# Altium schematic sheet ISD1730.SchDoc
size A; SheetNumber: 5; SheetTotal: 13
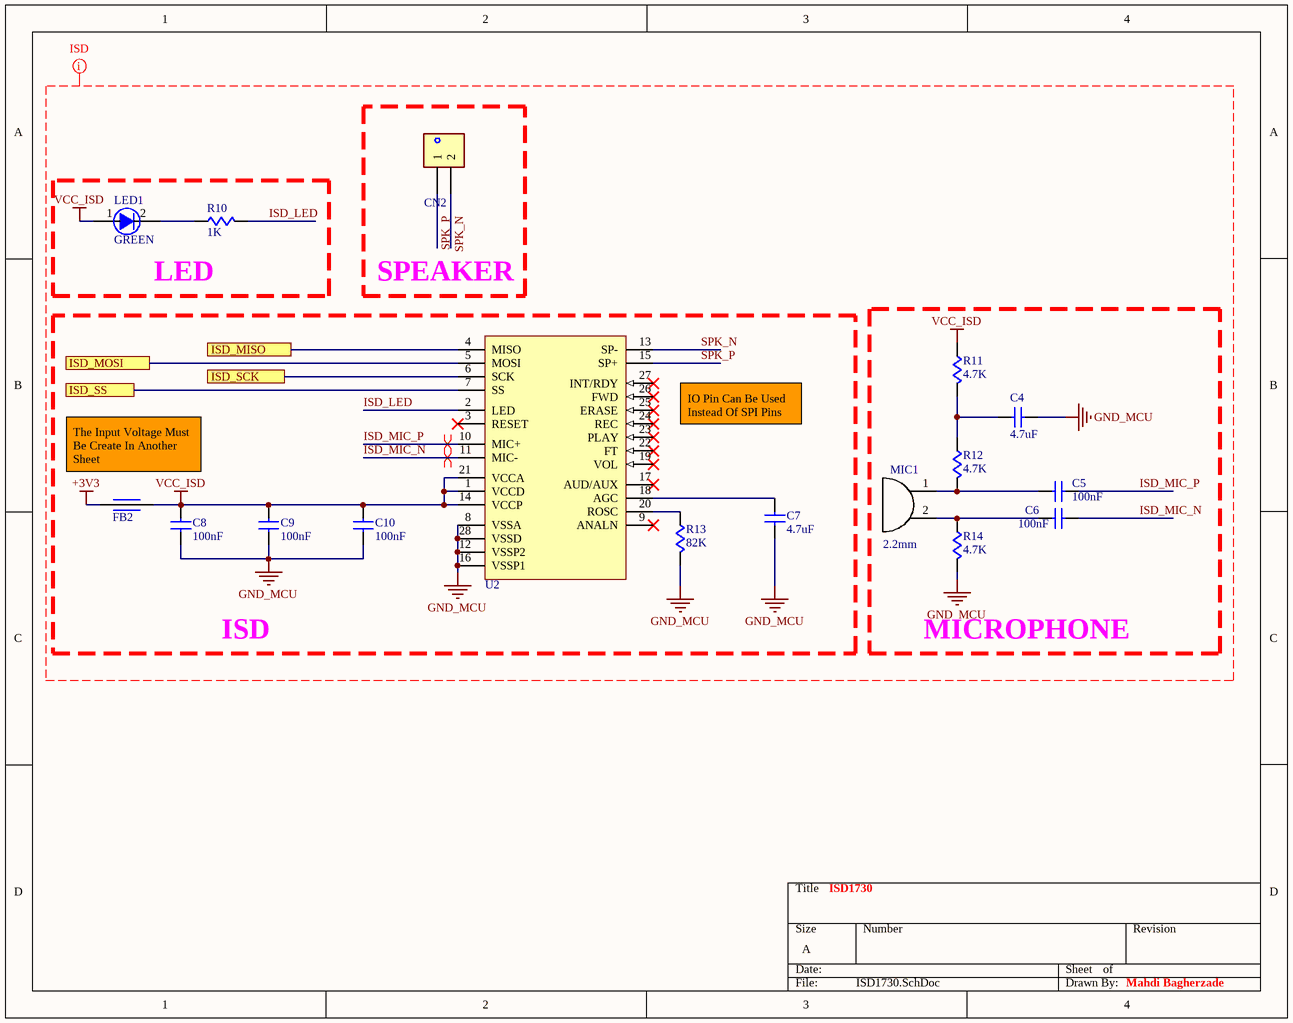
[diagram p0: ISD1730.SchDoc]

## Parts
C4  value 4.7uF  [C-0805]  (hidden comment: CAP Cer 4.7uF-50V-X7R-SMD)
C5  value 100nF  [C-0805]  (hidden comment: CAP Cer 100nF-50V-X7R-SMD)
C6  value 100nF  [C-0805]  (hidden comment: CAP Cer 100nF-50V-X7R-SMD)
C7  value 4.7uF  [C-0805]  (hidden comment: CAP Cer 4.7uF-50V-X7R-SMD)
C8  value 100nF  [C-0805]  (hidden comment: CAP Cer 100nF-50V-X7R-SMD)
C9  value 100nF  [C-0805]  (hidden comment: CAP Cer 100nF-50V-X7R-SMD)
C10  value 100nF  [C-0805]  (hidden comment: CAP Cer 100nF-50V-X7R-SMD)
CN2  Connector XH-2-Straight-THD-2.54mm  [XH-2]  (value not drawn)
FB2  Ferrite Bead SMD  [FB-0805]  (value not drawn)
LED1  Color: GREEN  [LED-1206-Y]  (hidden comment: LED GREEN-1206-SMD)
MIC1  Size: 2.2mm  [MIC-2.2mm]  (hidden comment: Mic 2.2mm-THD)
R10  value 1K  [R-0805]  (hidden comment: RES 1K-5%-1/8W-SMD)
R11  value 4.7K  [R-0805]  (hidden comment: RES 4.7K-5%-1/8W-SMD)
R12  value 4.7K  [R-0805]  (hidden comment: RES 4.7K-5%-1/8W-SMD)
R13  value 82K  [R-0805]  (hidden comment: RES 82K-5%-1/8W-SMD)
R14  value 4.7K  [R-0805]  (hidden comment: RES 4.7K-5%-1/8W-SMD)
U2  IC ISD1730-SMD  [SOIC28-wide]  (value not drawn)

## Blocks framed on the sheet
SPEAKER: CN2
LED: LED1 R10
ISD: C7-C10 FB2 R13 U2
MICROPHONE: C4-C6 MIC1 R11 R12 R14

## Ports
ISD_MISO (see Interface[3B]), ISD_MOSI (see Interface[3B]), ISD_SCK (see Interface[3B]), ISD_SS (see Interface[3B], MCU[3C])

## Nets
+3V3: FB2.1
GND_MCU: C4.2 C7.2 C8.2 C9.2 C10.2 R13.2 R14.2 U2.8(VSSA) U2.12(VSSP2) U2.16(VSSP1) U2.28(VSSD)
VCC_ISD: C8.1 C9.1 C10.1 FB2.2 LED1.1(A) R11.1 U2.1(VCCD) U2.14(VCCP) U2.21(VCCA)
ISD_LED: R10.2 U2.2(LED)
ISD_MIC_N: C6.2 U2.11(MIC-)
ISD_MIC_P: C5.2 U2.10(MIC+)
ISD_MISO: U2.4(MISO) ; port ISD_MISO
ISD_MOSI: U2.5(MOSI) ; port ISD_MOSI
ISD_SCK: U2.6(SCK) ; port ISD_SCK
ISD_SS: U2.7(SS) ; port ISD_SS
SPK_N: CN2.2 U2.13(SP-)
SPK_P: CN2.1 U2.15(SP+)
NetC4_1: C4.1 R11.2 R12.1
NetC5_1: C5.1 MIC1.1 R12.2
NetC6_1: C6.1 MIC1.2 R14.1
NetC7_1: C7.1 U2.18(AGC)
NetLED1_2: LED1.2(C) R10.1
NetR13_1: R13.1 U2.20(ROSC)

Not connected (* = marked no-connect by the designer): U2 3(RESET)* 9(ANALN)* 17(AUD/AUX)* 19(VOL)* 22(FT)* 23(PLAY)* 24(REC)* 25(ERASE)* 26(FWD)* 27(INT/RDY)*

## Layout directives
differential pair: ISD_MIC_N, ISD_MIC_P
net class ISD: +3V3, GND_MCU, ISD_LED, ISD_MIC_N, ISD_MIC_P, SPK_N, SPK_P, VCC_ISD

## Notes on the sheet
- IO Pin Can Be Used Instead Of SPI Pins
- The Input Voltage Must Be Create In Another Sheet
- ISD1730
- Mahdi Bagherzade

## Library data of the parts
C4-C10 = CAP-CER: CAPACITOR; Phone Number: 0915 8700 314; Voltage: 50V; Tolerance: X7R; Type: SMD; Publisher: Mahdi Bagherzadeh; ComponentLink1Description: Linkedin; ComponentLink1URL: https://ir.linkedin.com/in/mahdi-bagherzade; Published Date: 9-15-2024
CN2 = CN-2pin: CONNECTOR; Phone Number: 0915 8700 314; Value: XH-2; Publisher: Mahdi Bagherzadeh; ComponentLink1Description: Linkedin; ComponentLink1URL: https://ir.linkedin.com/in/mahdi-bagherzade; Published Date: 9-15-2024; Size: 2.54mm; Type: Straight-THD
FB2 = FERRITE BEAD: INDUCATOR; Phone Number: 0915 8700 314; Publisher: Mahdi Bagherzadeh; ComponentLink1Description: Linkedin; ComponentLink1URL: https://ir.linkedin.com/in/mahdi-bagherzade; Published Date: 9-15-2024; Type: SMD
LED1 = LED: Phone Number: 0915 8700 314; Type: SMD; Publisher: Mahdi Bagherzadeh; ComponentLink1Description: Linkedin; ComponentLink1URL: https://ir.linkedin.com/in/mahdi-bagherzade; Published Date: 9-15-2024; Size: 1206
MIC1 = MIC: Phone Number: 0915 8700 314; Publisher: Mahdi Bagherzadeh; ComponentLink1Description: Linkedin; ComponentLink1URL: https://ir.linkedin.com/in/mahdi-bagherzade; Published Date: 9-15-2024; Type: THD
R10-R14 = RES: RESISTOR; Phone Number: 0915 8700 314; Power: 1/8W; Tolerance: 5%; Publisher: Mahdi Bagherzadeh; ComponentLink1Description: Linkedin; ComponentLink1URL: https://ir.linkedin.com/in/mahdi-bagherzade; Published Date: 9-15-2024; Type: SMD
U2 = ISD1730: IC; Phone Number: 0915 8700 314; Publisher: Mahdi Bagherzadeh; ComponentLink1Description: Linkedin; ComponentLink1URL: https://ir.linkedin.com/in/mahdi-bagherzade; Published Date: 9-15-2024; Code: ISD1730; Type: SMD